# Altium project Isurudeshapriya_renewaa.PrjPcb
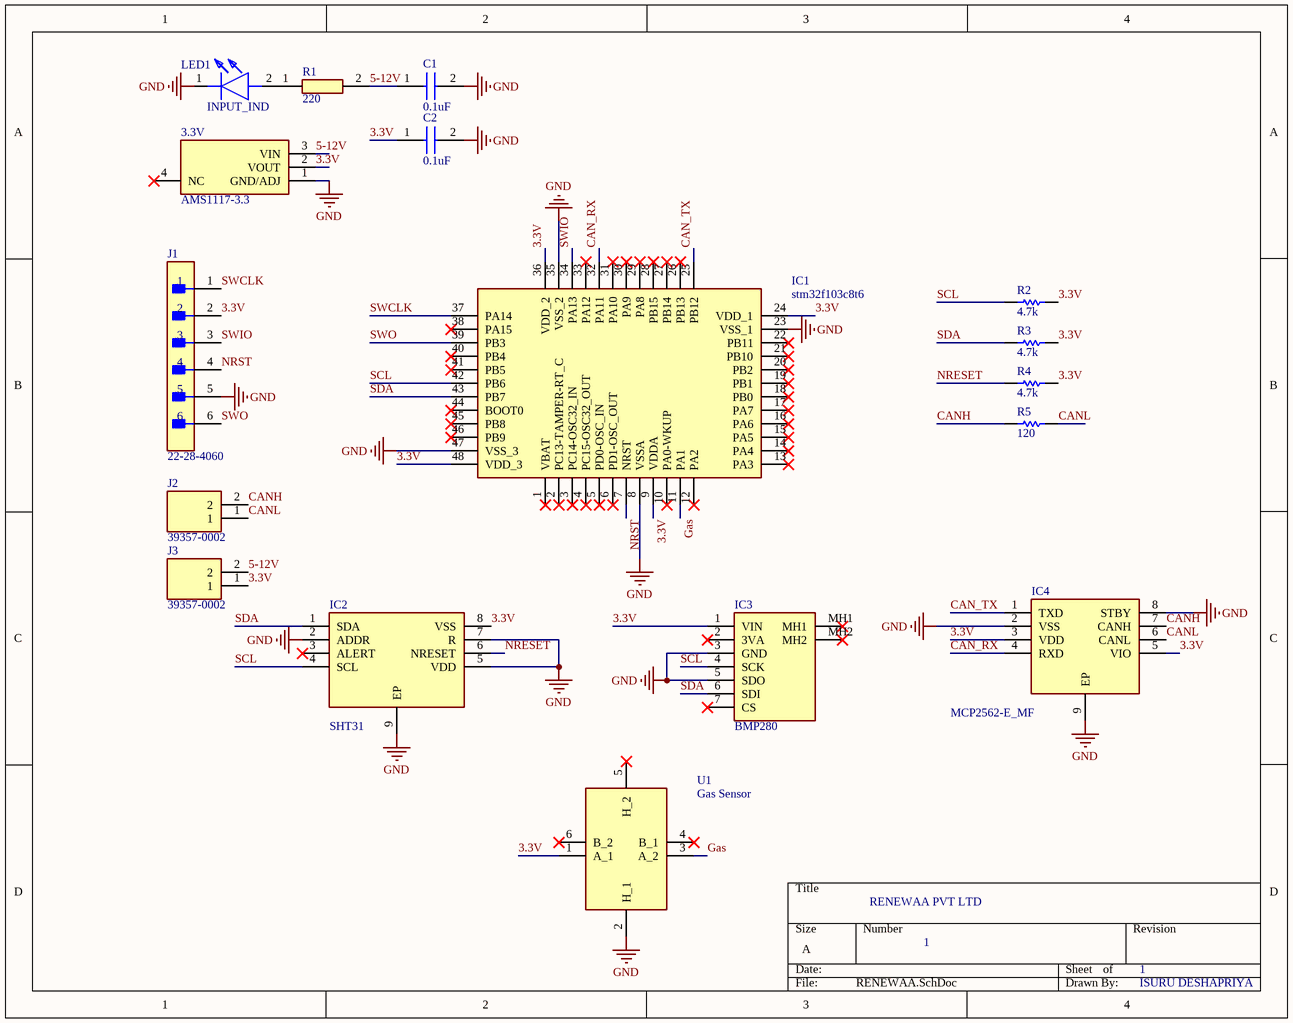
[diagram p0: RENEWAA.SchDoc]
1 sheet, 17 parts. Net scope: global (net labels, ports and power ports of the same name join across sheets).
Board file: RENEWAA.PcbDoc

## Sheet RENEWAA.SchDoc
size A; SheetNumber: 1; SheetTotal: 1

### Parts
3.3V  AMS1117-3.3  [SOT229P700X180-4N]
C1  0.1uF  [CAPC1005X56N]
C2  0.1uF  [CAPC1005X56N]
IC1  stm32f103c8t6  [QFP50P900X900X160-48N]
IC2  SHT31  [SON50P250X250X100-9N-D]
IC3  BMP280  [2651]
IC4  MCP2562-E_MF  [SON65P300X300X100-9N-D]
J1  22-28-4060  [FP-22-28-4060-MFG]
J2  39357-0002  [393570002]
J3  39357-0002  [393570002]
LED1  INPUT_IND  [1221S2CFR2S2L2C]
R1  220  [RESC1005X40N]
R2  4.7k  [RESC3216X60X45ML15T20]
R3  4.7k  [RESC3216X60X45ML15T20]
R4  4.7k  [RESC3216X60X45ML15T20]
R5  120  [RESC1609X55X30ML15T15]
U1  Gas Sensor  [60500009]

### Nets
GND: 3.3V.1(GND/ADJ) C1.2 C2.2 IC1.8(VSSA) IC1.23(VSS_1) IC1.35(VSS_2) IC1.47(VSS_3) IC2.2(ADDR) IC2.5(VDD) IC2.7(R) IC2.9(EP) IC3.3(GND) IC3.5(SDO) IC4.2(VSS) IC4.8(STBY) IC4.9(EP) J1.5 LED1.1(K) U1.2(H_1)
3.3V: 3.3V.2(VOUT) C2.1 IC1.9(VDDA) IC1.24(VDD_1) IC1.36(VDD_2) IC1.48(VDD_3) IC2.8(VSS) IC3.1(VIN) IC4.3(VDD) IC4.5(VIO) J1.2 J3.1 R2.2 R3.2 R4.2 U1.1(A_1)
5-12V: 3.3V.3(VIN) C1.1 J3.2 R1.2
CAN_RX: IC1.32(PA11) IC4.4(RXD)
CAN_TX: IC1.25(PB12) IC4.1(TXD)
CANH: IC4.7(CANH) J2.2 R5.1
CANL: IC4.6(CANL) J2.1 R5.2
Gas: IC1.11(PA1) U1.3(A_2)
NRESET: IC2.6(NRESET) R4.1
NRST: IC1.7(NRST) J1.4
SCL: IC1.42(PB6) IC2.4(SCL) IC3.4(SCK) R2.1
SDA: IC1.43(PB7) IC2.1(SDA) IC3.6(SDI) R3.1
SWCLK: IC1.37(PA14) J1.1
SWIO: IC1.34(PA13) J1.3
SWO: IC1.39(PB3) J1.6
NetLED1_2: LED1.2(A) R1.1

Not connected (* = marked no-connect by the designer): 3.3V 4(NC)*; IC1 1(VBAT)* 2(PC13-TAMPER-RT_C)* 3(PC14-OSC32_IN)* 4(PC15-OSC32_OUT)* 5(PD0-OSC_IN)* 6(PD1-OSC_OUT)* 10(PA0-WKUP)* 12(PA2)* 13(PA3)* 14(PA4)* 15(PA5)* 16(PA6)* 17(PA7)* 18(PB0)* 19(PB1)* 20(PB2)* 21(PB10)* 22(PB11)* 26(PB13)* 27(PB14)* 28(PB15)* 29(PA8)* 30(PA9)* 31(PA10)* 33(PA12)* 38(PA15)* 40(PB4)* 41(PB5)* 44(BOOT0)* 45(PB8)* 46(PB9)*; IC2 3(ALERT)*; IC3 2(3VA)* 7(CS)* MH1* MH2*; U1 4(B_1)* 5(H_2)* 6(B_2)*

### Notes on the sheet
- RENEWAA PVT LTD
- 1
- ISURU DESHAPRIYA

### Library data of the parts
3.3V = AMS1117-3.3: Integrated Circuit; Manufacturer_Name: Advanced; Datasheet Link: https://datasheet.datasheetarchive.com/originals/distributors/Datasheets-28/DSA-550594.pdf; Height: 1.8mm; Manufacturer_Part_Number: AMS1117-3.3
C1 C2 = 04024D106MAT2A: Capacitor; Manufacturer_Name: Kyocera AVX; Datasheet Link: http://www.mouser.com/catalog/supplier/library/pdf/AVXSurfaceMountCeramic.pdf; Height: 0.56mm; Manufacturer_Part_Number: 04024D106MAT2A; Mouser Part Number: 581-04024D106MAT2A; Mouser Price/Stock: https://www.mouser.co.uk/ProductDetail/KYOCERA-AVX/04024D106MAT2A?qs=NBFAU1oqP4W0zKsr62mI7A%3D%3D
IC1 = stm32f103c8t6: Integrated Circuit; Manufacturer_Name: STMicroelectronics; Datasheet Link: http://media.digikey.com/pdf/Data%20Sheets/ST%20Microelectronics%20PDFS/STM32F103x8,B.pdf; Height: 1.6mm; Manufacturer_Part_Number: stm32f103c8t6; Mouser Part Number: 511-STM32F103C8T6; Mouser Price/Stock: https://www.mouser.co.uk/ProductDetail/STMicroelectronics/STM32F103C8T6?qs=bhCVus9SdFtq6kqxsU5%2FDA%3D%3D; Arrow Part Number: STM32F103C8T6; Arrow Price/Stock: https://www.arrow.com/en/products/stm32f103c8t6/stmicroelectronics?utm_currency=USD&region=nac
IC2 = SHT31-DIS-B10KS: Integrated Circuit; Manufacturer_Name: Sensirion; Datasheet Link: https://www.arrow.com/en/products/sht31-dis-b10ks/sensirion-ag?region=nac; Height: 1mm; Manufacturer_Part_Number: SHT31-DIS-B10KS; Mouser Part Number: 403-SHT31-DIS-B10KS; Mouser Price/Stock: https://www.mouser.co.uk/ProductDetail/Sensirion/SHT31-DIS-B10kS?qs=MLItCLRbWswwYf53rVT5pw%3D%3D; Arrow Part Number: SHT31-DIS-B10KS; Arrow Price/Stock: https://www.arrow.com/en/products/sht31-dis-b10ks/sensirion-ag?utm_currency=USD&region=nac
IC3 = 2651: Integrated Circuit; Manufacturer_Name: Adafruit; Datasheet Link: https://learn.adafruit.com/downloads/pdf/adafruit-bmp280-barometric-pressure-plus-temperature-sensor-breakout.pdf; Height: 3mm; Manufacturer_Part_Number: 2651; Mouser Part Number: 485-2651; Mouser Price/Stock: https://www.mouser.co.uk/ProductDetail/Adafruit/2651?qs=GP1oqPAcsMG0HimHwVa7aA%3D%3D; Arrow Part Number: 2651; Arrow Price/Stock: https://www.arrow.com/en/products/2651/adafruit-industries?region=nac
IC4 = MCP2562-E_MF: Integrated Circuit; Manufacturer_Name: Microchip; Manufacturer_Part_Number: MCP2562-E/MF; Datasheet Link: http://uk.rs-online.com/web/p/products/1652039; Height: 1mm; Mouser Part Number: 579-MCP2562-E/MF; Mouser Price/Stock: https://www.mouser.co.uk/ProductDetail/Microchip-Technology/MCP2562-E-MF?qs=6qKXPk0vzx2iHVWjPcssaQ%3D%3D; Arrow Part Number: MCP2562-E/MF; Arrow Price/Stock: https://www.arrow.com/en/products/mcp2562-emf/microchip-technology?region=europe
J1 = CMP-04776-000763-1: CONN HEADER VERT 6POS 2.54MM; Voltage Rating: 250V; Current Rating: 4A; Number of Contacts: 6; Max Voltage Rating (DC): 250.25kV; Gender: Male; Contact Resistance: 20mR; Connector Type: Male Pin; Color: Black; Max Voltage Rating (AC): 250V; Pitch: 2.54mm; Orientation: Straight; Max Operating Temperature: 75°C; Contact Plating: Tin; Depth: 2.49mm; Contact Type: Male Pin; Number of Positions: 6; Length: 15.24mm; Packaging: Bulk; Mount: Through Hole; Housing Material: Thermoplastic; Housing Color: Black; Termination: Solder; Contact Material: Brass; Min Operating Temperature: 0°C; Series: KK® 42375; Number of Rows: 1; Package Quantity: 1; RoHS Compliant: Yes; Contact Mating Length: 0.24inch
J2 J3 = 39357-0002: Connector; Manufacturer_Name: Molex; Datasheet Link: https://www.molex.com/pdm_docs/sd/393570002_sd.pdf; Height: 8.64mm; Manufacturer_Part_Number: 39357-0002; Mouser Part Number: 538-39357-0002; Mouser Price/Stock: https://www.mouser.co.uk/ProductDetail/Molex/39357-0002?qs=c7V%252BsbZfmqvL0V%252BWJEAGdg%3D%3D
LED1 = 12-21_S2C-FR2S2L_2C: LED; Manufacturer_Name: Everlight; Manufacturer_Part_Number: 12-21/S2C-FR2S2L/2C; Datasheet Link: https://datasheet.lcsc.com/szlcsc/1901141904_Everlight-Elec-12-21-S2C-FR2S2L-2C_C183856.pdf; Height: 2.2mm
R1 = CR0402-FX-2200GLF: Resistor; Manufacturer_Name: Bourns; Datasheet Link: https://www.bourns.com/pdfs/CR0402.pdf; Height: 0.4mm; Manufacturer_Part_Number: CR0402-FX-2200GLF; Mouser Part Number: 652-CR0402FX-2200GLF; Mouser Price/Stock: https://www.mouser.co.uk/ProductDetail/Bourns/CR0402-FX-2200GLF?qs=JflQ4L8so%2FsKYc57KXfYtQ%3D%3D; Arrow Part Number: CR0402-FX-2200GLF; Arrow Price/Stock: https://www.arrow.com/en/products/cr0402-fx-2200glf/bourns
R2-R4 = CMP-2100-03618-1: Chip Resistor, 4.7 KOhm, +/- 1%, 0.25 W, -55 to 155 degC, 1206 (3216 Metric), RoHS, Tape and Reel; Manufacturer: Vishay Semiconductor; Power Rating: 250mW; Voltage Rating: 200V; Temperature Coefficient: 100ppm/degreesC; Package Quantity: 10; Composition: ThickFilm; REACH SVHC: Unknown; Mount: SurfaceMount; Max Operating Temperature: 155degC; Length: 3.2mm; Number of Terminations: 2; Case Code (Metric): 3216; Military Standard: Not; Width: 1.6mm; Datasheet Version: 41061.0; Max Power Dissipation: 250mW; Datasheet URL: http://www.vishay.com/docs/20035/dcrcwe3.pdf; Contact Plating: Tin; Case/Package: 1206; Height: 0.55mm; Package Reference: 1206.0; Lead Free: LeadFree; Weight: 0.000353oz; Package Description: 2-Pin Surface Mount Device, Body 3.15 x 1.6 mm; Min Operating Temperature: -55degC; Resistance: 4.7KOhm; Packaging: TapeandReel; Depth: 1.6mm; Tolerance: 1%; RoHSCompliant: true; Termination: SMD/SMT; Case Code (Imperial): 1206; Voltage Rating (DC): 200V; Radiation Hardening: No; Manufacturer URL: http://www.vishay.com/
R5 = CMP-2000-00213-2: Chip Resistor, 120 Ohm, +/- 1%, 0.1 W, -55 to 155 degC, 0603 (1608 Metric), RoHS, Tape and Reel; Manufacturer: Panasonic; Power Rating: 100mW; Voltage Rating (DC): 75V; Resistance: 120Ohm; Temperature Coefficient: 100ppm/degreesC; Number of Terminations: 2; Military Standard: Not; Tolerance: 1%; Min Operating Temperature: -55degC; Packaging: TapeandReel; Lead Free: LeadFree; Max Operating Temperature: 155degC; Manufacturer URL: http://www.panasonic.com/; Case Code (Imperial): 0603; REACH SVHC: NoSVHC; Width: 0.031inch; Datasheet URL: https://industrial.panasonic.com/cdbs/www-data/pdf/RDA0000/AOA0000C283.pdf; RoHSCompliant: true; Max Power Dissipation: 100mW; Termination: SMD/SMT; Package Reference: 0603; Height: 0.022inch; Depth: 0.8mm; Package Description: 2-Pin Surface Mount Device, Body 1.6 x 0.85 mm; Contact Plating: Tin; Length: 1.6mm; Package URL: http://www.st.com/st-web-ui/static/active/en/resource/technical/document/datasheet/CD00001320.pdf; Radiation Hardening: No; Package Quantity: 1; Number of Pins: 2; Datasheet Version: 42095.0; Voltage Rating: 75V; Composition: ThickFilm; Case/Package: 0603; Mount: SurfaceMount; Case Code (Metric): 1608
U1 = 605-00009: MQ-2; Manufacturer_Name: Parallax; Datasheet Link: https://datasheet.datasheetarchive.com/originals/distributors/DKDS-18/349907.pdf; Height: 10mm; Manufacturer_Part_Number: 605-00009; Mouser Part Number: 619-605-00009; Mouser Price/Stock: https://www.mouser.co.uk/ProductDetail/Parallax/605-00009?qs=c8dSG9xvwkc3Fl0aFi4nyw%3D%3D